# EAGLE design xpmfitter (EAGLE 9.6.2)
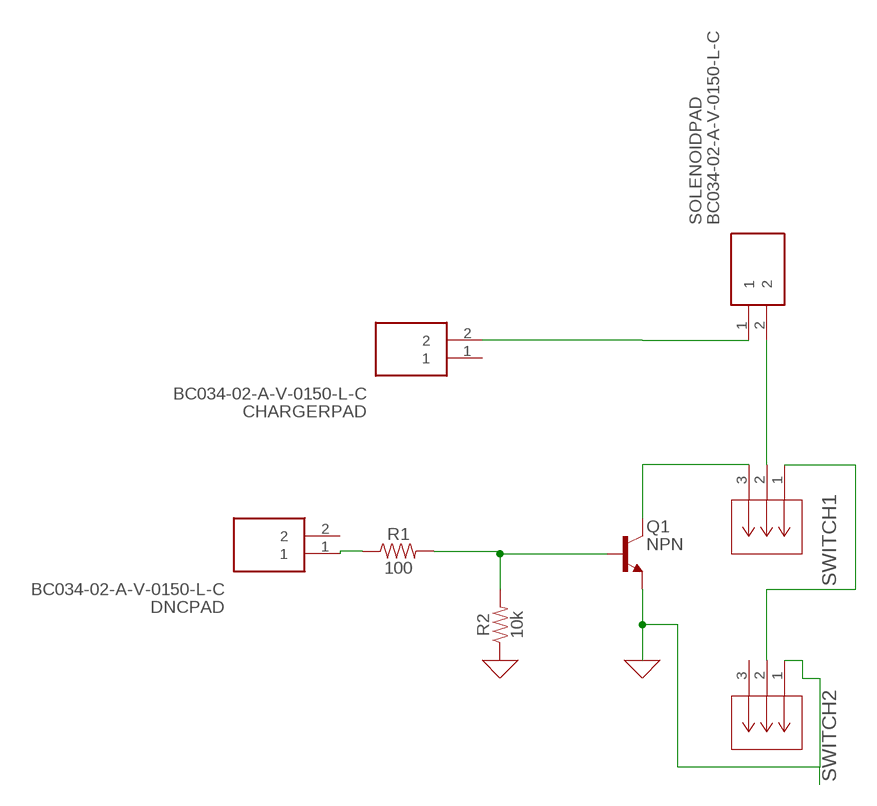
[diagram p0: schematic, sheet 1]

## Parts
CHARGERPAD  BC034-02-A-V-0150-L-C  [BC03402AV0150LC]
DNCPAD  BC034-02-A-V-0150-L-C  [BC03402AV0150LC]
Q1  NPN  NPN_SC59-BEC  [SC59]
R1  100  100OHM-0603-1/10W-1%  [0603]
R2  10k  10KOHM-0603-1/10W-1%  [0603]
SOLENOIDPAD  BC034-02-A-V-0150-L-C  [BC03402AV0150LC]
SWITCH1  GRPB031VWTC-RCCONN3_GRPB031_SUL  [CONN3_GRPB031_SUL]
SWITCH2  GRPB031VWTC-RCCONN3_GRPB031_SUL  [CONN3_GRPB031_SUL]

## Nets
GND: Q1.E R2.1 SWITCH2.1
N$1: Q1.B R1.2 R2.2
N$2: Q1.C SWITCH1.3
N$3: CHARGERPAD.2 SOLENOIDPAD.1
N$4: DNCPAD.1 R1.1
N$5: SOLENOIDPAD.2 SWITCH1.2
N$7: SWITCH1.1 SWITCH2.2
Unconnected: CHARGERPAD.1 DNCPAD.2 SWITCH2.3

## Library data of the parts
CHARGERPAD DNCPAD SOLENOIDPAD = BC034-02-A-V-0150-L-C:BC034-02-A-V-0150-L-C: 2POS 1.0MM PITCH HEADER, SIL, SM Source: Datasheet <https://www.mouser.tw/datasheet/2/837/BC034-1948652.pdf>; DESCRIPTION: 2POS 1.0MM PITCH HEADER, SIL, SM; HEIGHT: 1.7mm; MANUFACTURER_NAME: GCT (GLOBAL CONNECTOR TECHNOLOGY); MANUFACTURER_PART_NUMBER: BC034-02-A-V-0150-L-C; MOUSER_PART_NUMBER: 640-BC03402AV0150LC; MOUSER_PRICE-STOCK: https://www.mouser.co.uk/ProductDetail/GCT/BC034-02-A-V-0150-L-C?qs=KUoIvG%2F9IlbeWpXlrIkoKg%3D%3D
Q1 = Transistor:NPN: NPN - Generic; CATEGORY: Transistor; SUB-CATEGORY: BJT; TYPE: NPN
R1 = SparkFun-Resistors:100OHM: 100Ω resistor A resistor is a passive two-terminal electrical component that implements electrical resistance as a circuit element. Resistors act to reduce current flow, and, at the same time, act to lower voltage levels within circuits. - Wikipedia; PROD_ID: RES-07863
R2 = SparkFun-Resistors:10KOHM: 10kΩ resistor A resistor is a passive two-terminal electrical component that implements electrical resistance as a circuit element. Resistors act to reduce current flow, and, at the same time, act to lower voltage levels within circuits. - Wikipedia; PROD_ID: RES-00824
SWITCH1 SWITCH2 = 2023-07-05_22-26-30_Library:GRPB031VWTC-RC; COPYRIGHT: Copyright (C) 2023 Ultra Librarian. All rights reserved.; MANUFACTURER_PART_NUMBER: GRPB031VWTC-RC; MFR_NAME: Sullins; TYPE: Headers, Male Pins

## Board
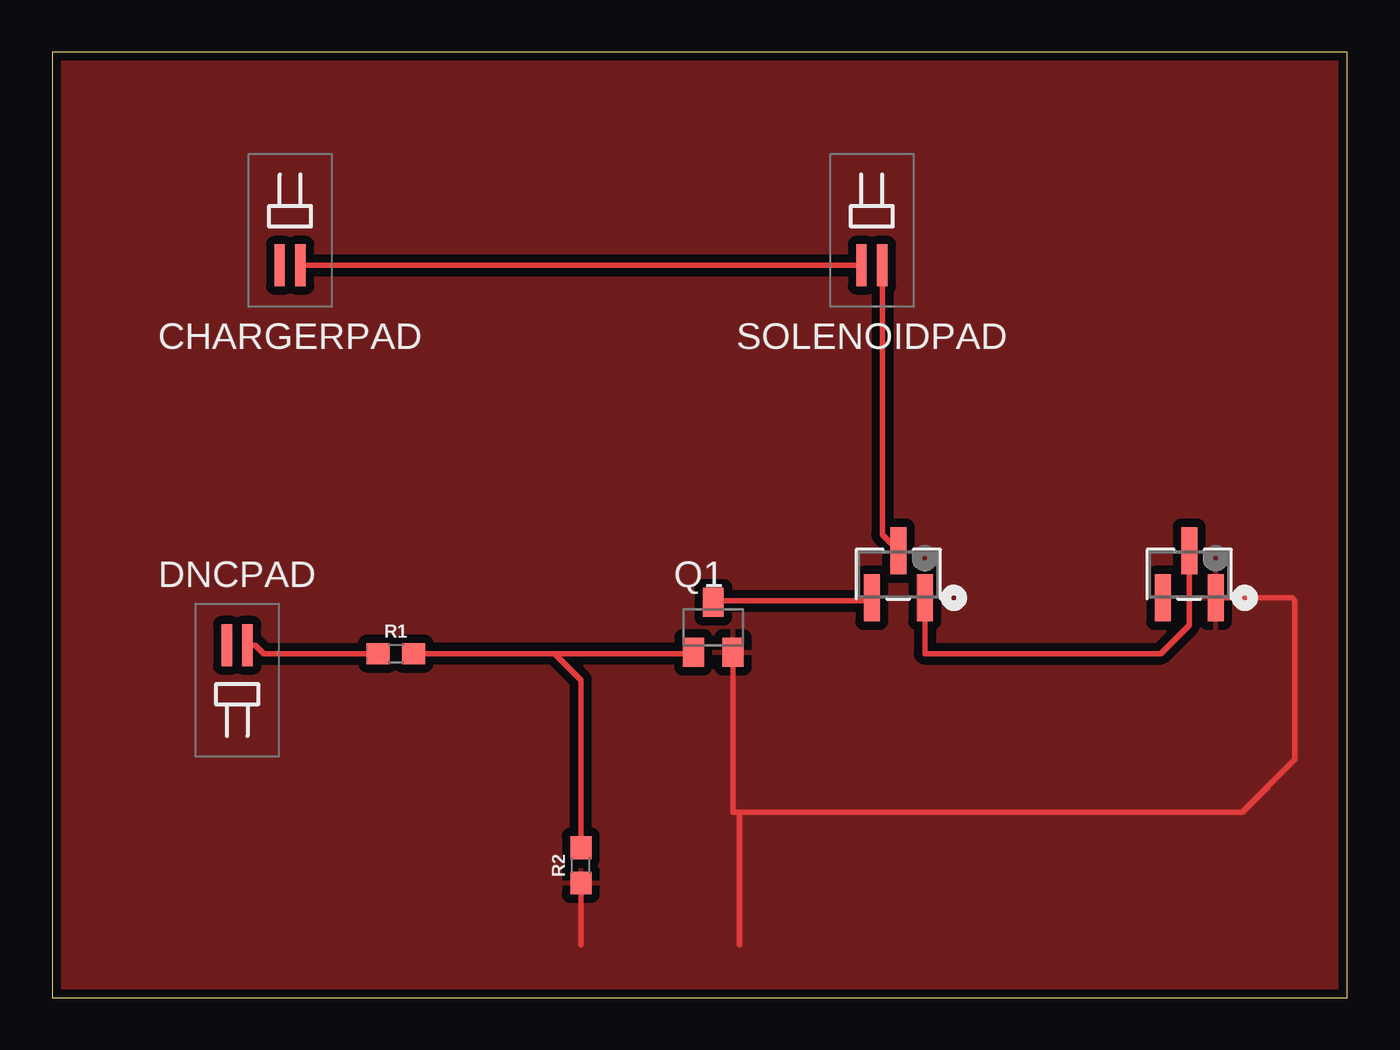
[diagram p1: board, top side]
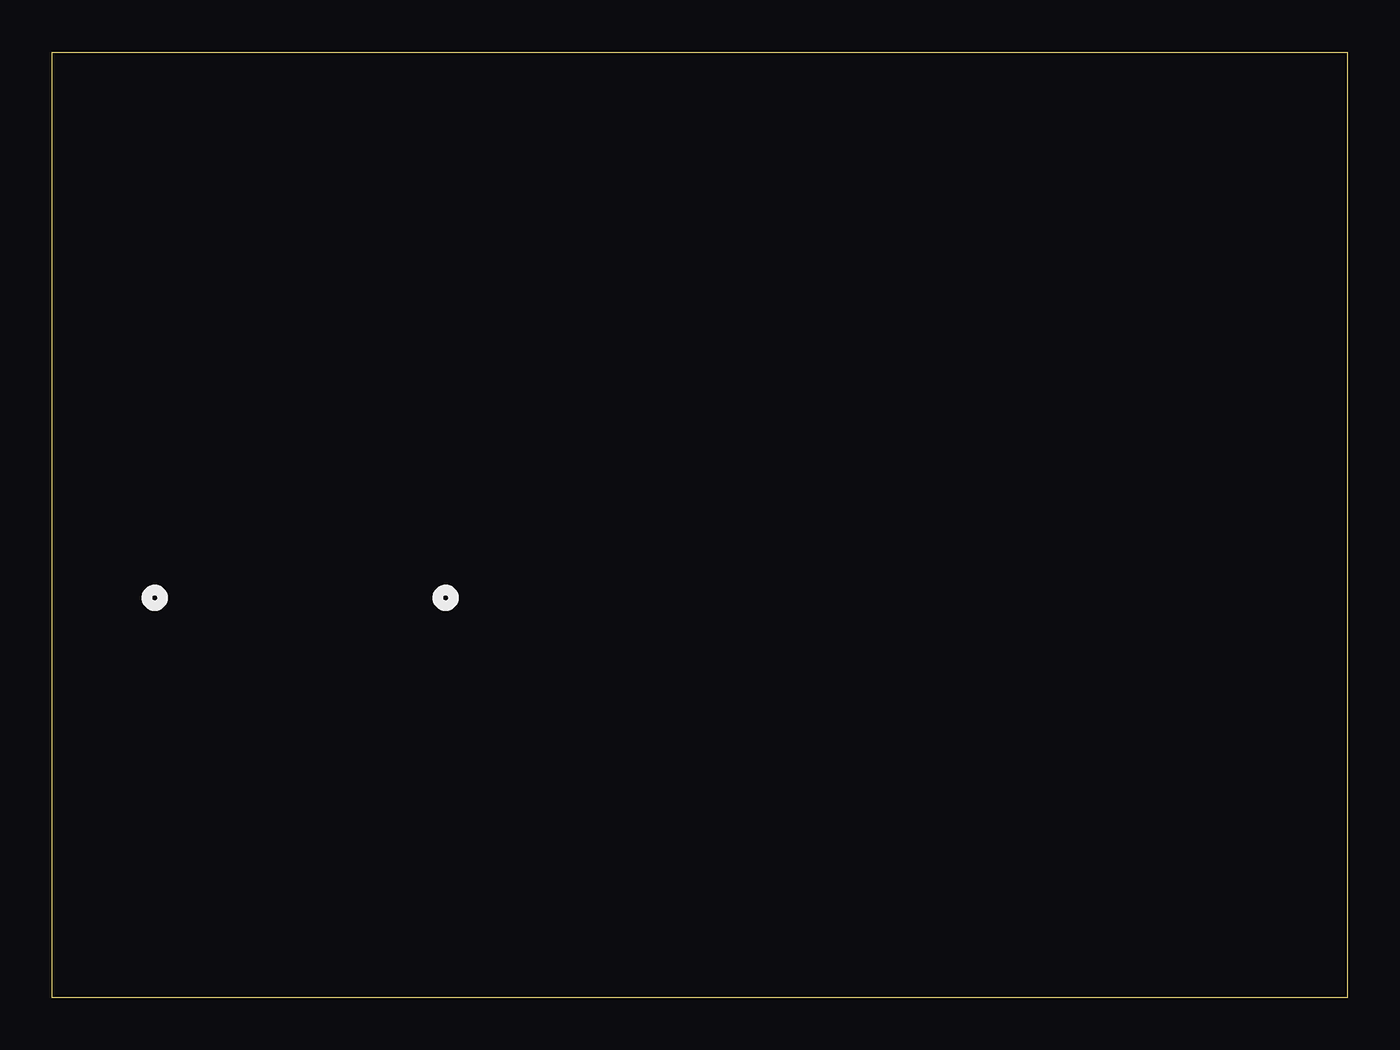
[diagram p2: board, bottom side, seen from below]

Size 62.21 x 45.39 mm. Coordinates in mm from the lower left corner, seen from the top.
Outline: 0,0 62.21,0 62.21,45.39 0,45.39 0,0
Copper layers (1*16): Top 0.035mm / dielectric 1.5mm / Bottom 0.035mm
Design rules "fabcity-designrules": minimum track width 10mil, minimum drill 32mil, track to track 16mil, track to pad 16mil, pad to pad 16mil, via to via 16mil, smd to smd 6mil, copper to edge 16mil, drill to drill 16mil, minimum pad ring 10mil, minimum via ring 8mil, stop-mask expansion 4mil, vias tented up to drill 0mil, thermal gap 16mil

### Footprints (pad centres in the part's own frame; a part is rotated, then mirrored left to right if it is on the bottom)
BC03402AV0150LC = smd 0.5 x 2: 1 -0.5,-1.675; 2 0.5,-1.675
SC59 = smd 1 x 1.4: B -0.95,-1.2; C 0,1.2; E 0.95,-1.2
0603 = smd 1.1 x 1: 1 -0.85,0; 2 0.85,0
CONN3_GRPB031_SUL = smd 0.762 x 2.261: 1 1.27,-1.13; 2 0,1.13; 3 -1.27,-1.13

### Placement (x,y rotation side)
CHARGERPAD  11.43,36.83 0 top
DNCPAD  8.89,15.24 180 top
Q1  31.75,17.78 0 top
R1  16.51,16.51 0 top
R2  25.4,6.35 90 top
SOLENOIDPAD  39.37,36.83 0 top
SWITCH1  40.64,20.32 0 top
SWITCH2  54.61,20.32 0 top

### Tracks (layer width: path | path; a pad name or v marks a point on that pad's centre or on a via)
GND
  Top 0.254: SWITCH2.1 59.55,19.19 59.69,19.05 59.69,11.43 57.15,8.89 33.02,8.89 | 33.02,8.89 32.7,8.89 Q1.E | 33.02,8.89 33.02,2.54 | R2.1 25.4,2.54
  pour Top: 0,47.1 0,0 62.23,0 62.23,45.75
N$1
  Top 0.254: R2.2 25.4,15.24 24.13,16.51 | 24.13,16.51 30.73,16.51 Q1.B | 24.13,16.51 R1.2
N$2
  Top 0.254: SWITCH1.3 39.23,19.05 31.75,19.05 Q1.C
N$3
  Top 0.254: CHARGERPAD.2 SOLENOIDPAD.1
N$4
  Top 0.254: DNCPAD.1 9.76,16.91 10.16,16.51 R1.1
N$5
  Top 0.254: SOLENOIDPAD.2 39.87,22.22 SWITCH1.2
N$7
  Top 0.254: SWITCH1.1 41.91,16.51 53.24,16.51 54.61,17.88 SWITCH2.2